# Altium schematic sheet FPGA_GTP.SchDoc: GTP and SATA
size 420 x 297 mm; CheckedBy: T.Janicki; CompanyName: Creotech Instruments SA; DrawnBy: G.Kasprowicz; Organization: CERN; Address1: European Organization for Nuclear Research; Address2: CH-1211 Geneve 23 - Switzerland; DocumentNumber: 10; Revision: -; SheetNumber: 11; SheetTotal: 21; EDA_Number: EDA-xxxx; Projet: Simple VME FMC Carrier; CreateDate: 20/11/2012; CheckedDate: 30/04/2012; DivGrp: BE-CO; Designer: G.Kasprowicz; DocumentName: Fpga_gtp.SchDoc; ModifiedDate: -; Rule: PcbType=ProtelPcb
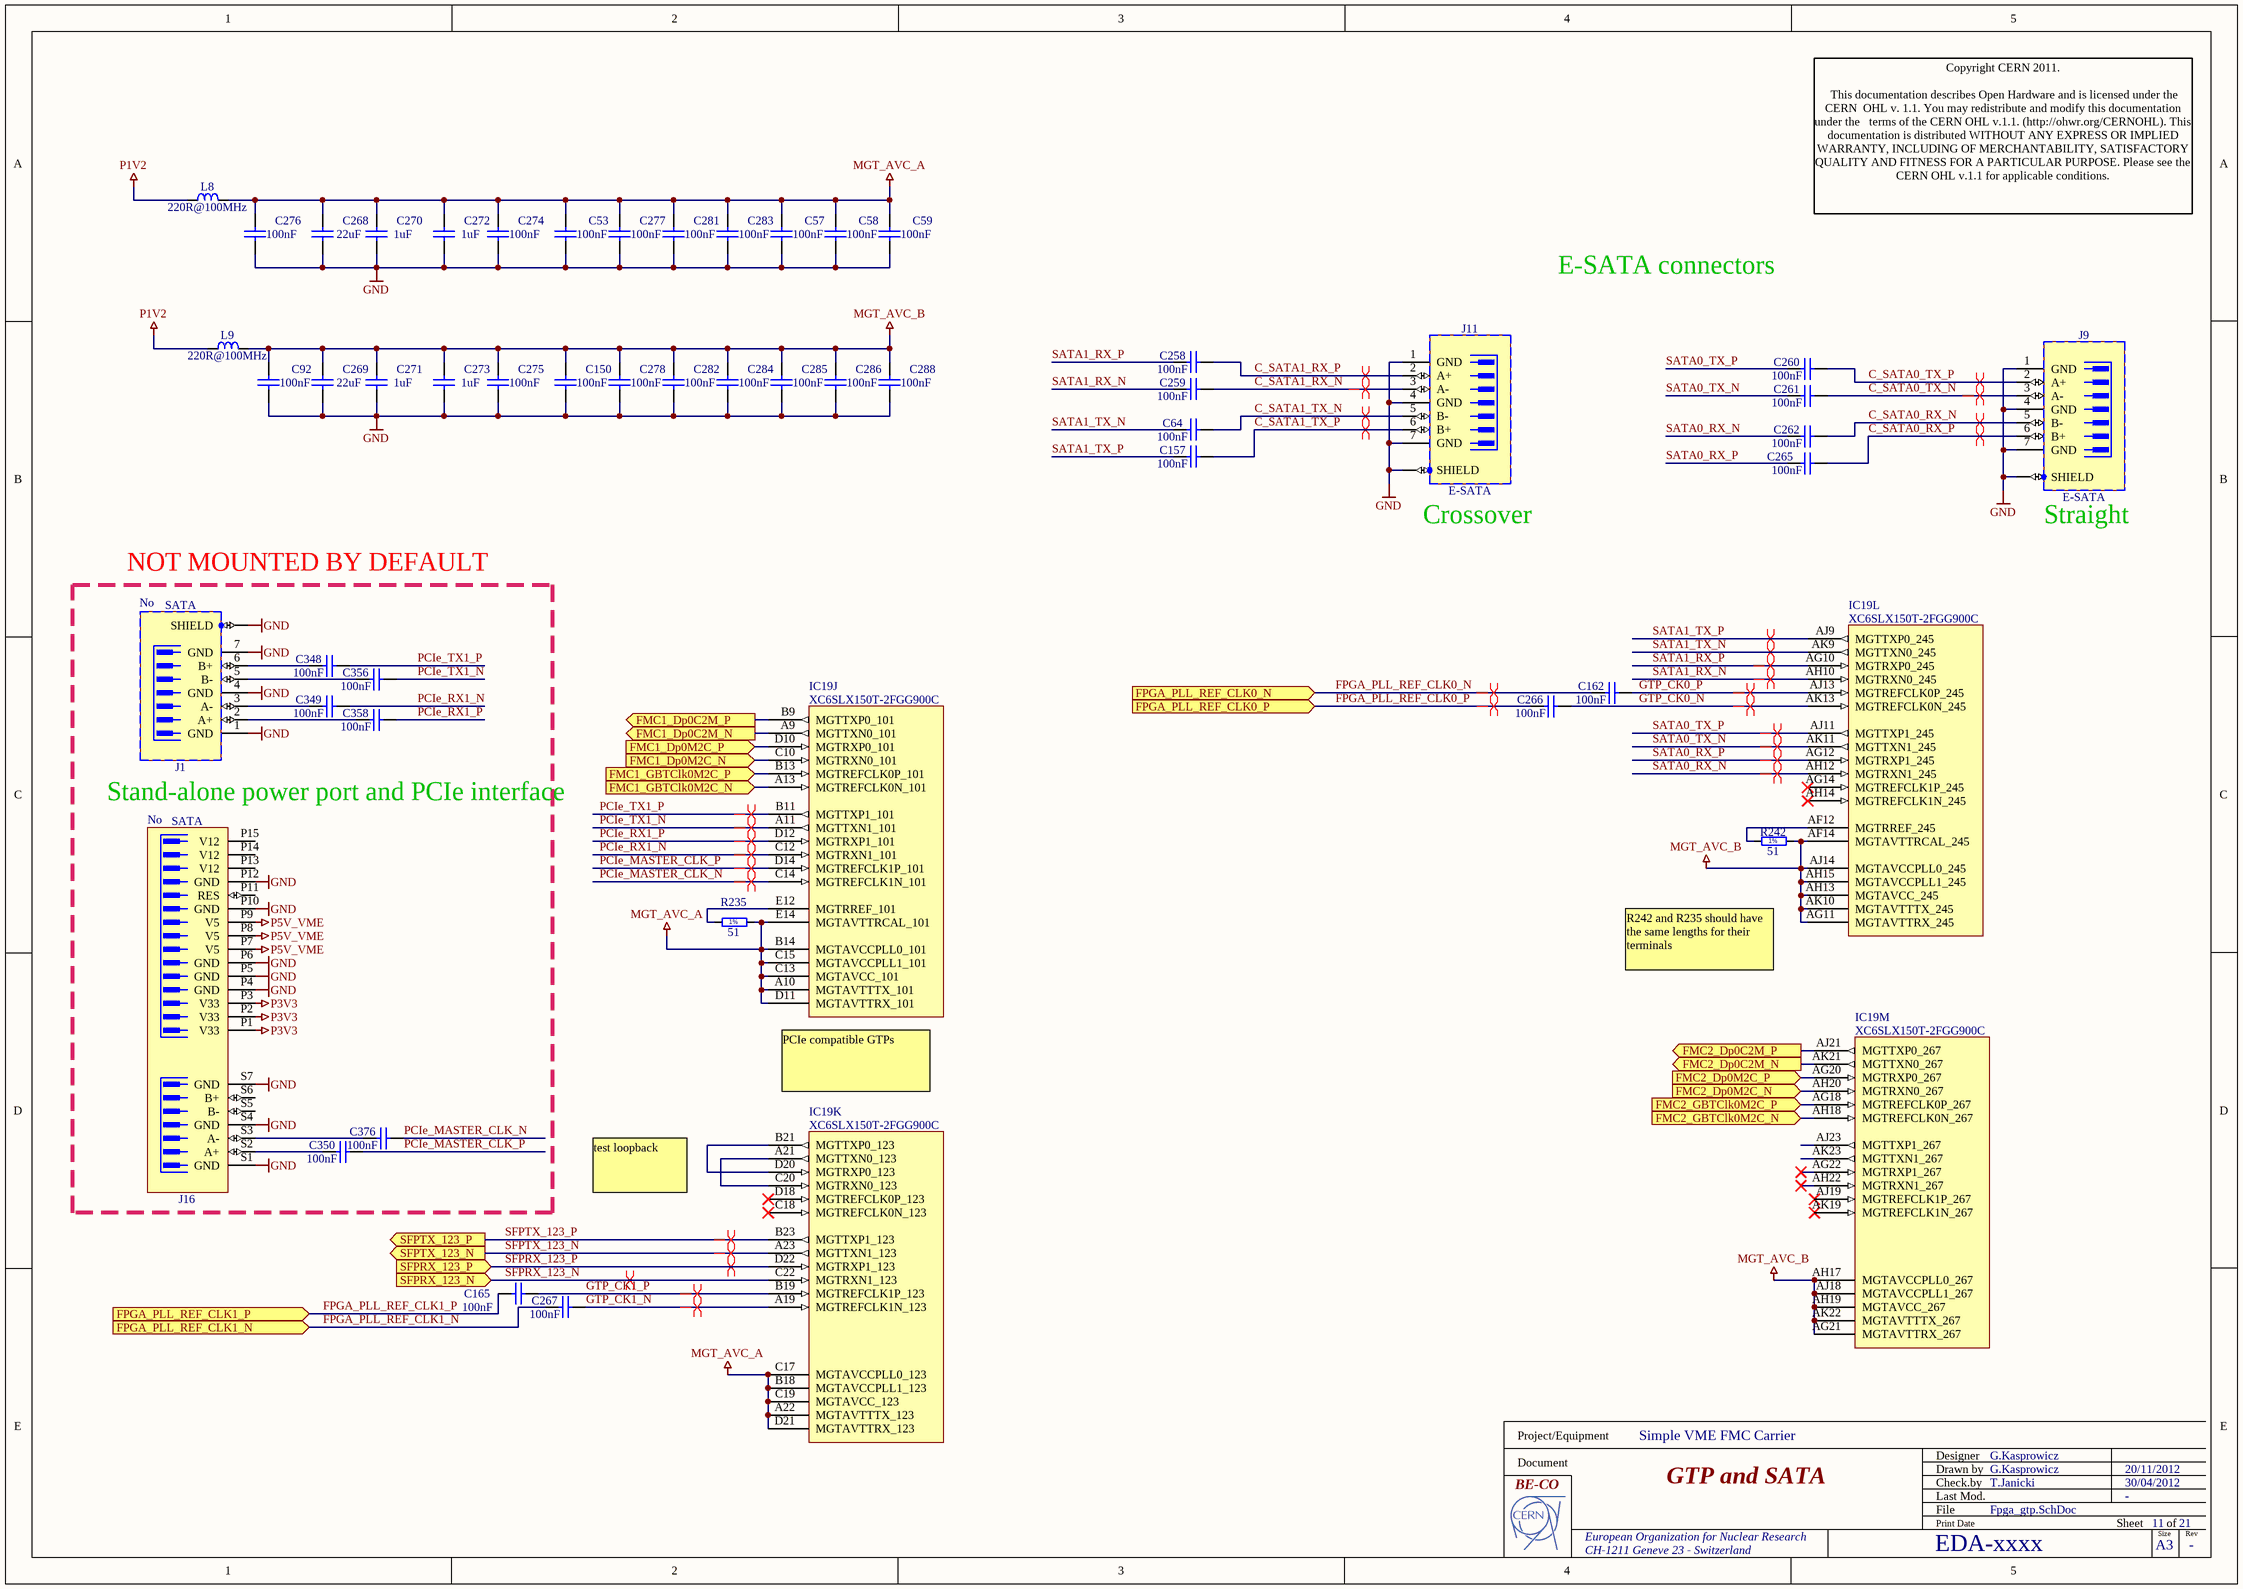
[diagram p0: FPGA_GTP.SchDoc]

## Parts
C53  100nF  [CAPC1005X55N]
C57  100nF  [CAPC1005X55N]
C58  100nF  [CAPC1005X55N]
C59  100nF  [CAPC1005X55N]
C64  100nF  [CAPC1005X55N]
C92  100nF  [CAPC1005X55N]
C150  100nF  [CAPC1005X55N]
C157  100nF  [CAPC1005X55N]
C162  100nF  [CAPC1005X55N]
C165  100nF  [CAPC1005X55N]
C258  100nF  [CAPC1005X55N]
C259  100nF  [CAPC1005X55N]
C260  100nF  [CAPC1005X55N]
C261  100nF  [CAPC1005X55N]
C262  100nF  [CAPC1005X55N]
C265  100nF  [CAPC1005X55N]
C266  100nF  [CAPC1005X55N]
C267  100nF  [CAPC1005X55N]
C268  22uF  [CAPC3216X180N]
C269  22uF  [CAPC3216X180N]
C270  1uF  [CAPC1608X87N]
C271  1uF  [CAPC1608X87N]
C272  1uF  [CAPC1608X87N]
C273  1uF  [CAPC1608X87N]
C274  100nF  [CAPC1005X55N]
C275  100nF  [CAPC1005X55N]
C276  100nF  [CAPC1005X55N]
C277  100nF  [CAPC1005X55N]
C278  100nF  [CAPC1005X55N]
C281  100nF  [CAPC1005X55N]
C282  100nF  [CAPC1005X55N]
C283  100nF  [CAPC1005X55N]
C284  100nF  [CAPC1005X55N]
C285  100nF  [CAPC1005X55N]
C286  100nF  [CAPC1005X55N]
C288  100nF  [CAPC1005X55N]
C348  100nF  [CAPC1005X55N]
C349  100nF  [CAPC1005X55N]
C350  100nF  [CAPC1005X55N]
C356  100nF  [CAPC1005X55N]
C358  100nF  [CAPC1005X55N]
C376  100nF  [CAPC1005X55N]
IC19  XC6SLX150T-2FGG900C  [BGA900C100P30X30_3100X3100X260]  (parts J,K,L,M of 18)
J1  SATA  Mounted: No  [3M_5607-4200-SH]
J9  E-SATA  [FCI_10074141-001LF]
J11  E-SATA  [FCI_10074141-001LF]
J16  SATA  Mounted: No  [MOLEX_87703-0001]
L8  220R@100MHz  [INDC2012X105N]
L9  220R@100MHz  [INDC2012X105N]
R235  51  [RESC1005X40N]
R242  51  [RESC1005X40N]

## Ports
FMC1_Dp0C2M_N (out), FMC1_Dp0C2M_P (out), FMC1_Dp0M2C_N (in), FMC1_Dp0M2C_P (in), FMC1_GBTClk0M2C_N (in), FMC1_GBTClk0M2C_P (in), FMC2_Dp0C2M_N (out), FMC2_Dp0C2M_P (out), FMC2_Dp0M2C_N (in), FMC2_Dp0M2C_P (in), FMC2_GBTClk0M2C_N (in), FMC2_GBTClk0M2C_P (in), FPGA_PLL_REF_CLK0_N (in), FPGA_PLL_REF_CLK0_P (in), FPGA_PLL_REF_CLK1_N (in), FPGA_PLL_REF_CLK1_P (in), SFPRX_123_N (in), SFPRX_123_P (in), SFPTX_123_N (out), SFPTX_123_P (out)

## Nets
GND: C53.1 C57.1 C58.1 C59.1 C92.1 C150.1 C268.1 C269.1 C270.1 C271.1 C272.1 C273.1 C274.1 C275.1 C276.1 C277.1 C278.1 C281.1 C282.1 C283.1 C284.1 C285.1 C286.1 C288.1 J1.1(GND) J1.4(GND) J1.7(GND) J1.8(SHIELD) J9.1(GND) J9.4(GND) J9.7(GND) J9.8(SHIELD) J11.1(GND) J11.4(GND) J11.7(GND) J11.8(SHIELD) J16.P4(GND) J16.P5(GND) J16.P6(GND) J16.P10(GND) J16.P12(GND) J16.S1(GND) J16.S4(GND) J16.S7(GND)
MGT_AVC_A: C53.2 C57.2 C58.2 C59.2 C268.2 C270.2 C272.2 C274.2 C276.2 C277.2 C281.2 C283.2 IC19.A10(MGTAVTTTX_101) IC19.A22(MGTAVTTTX_123) IC19.B14(MGTAVCCPLL0_101) IC19.B18(MGTAVCCPLL1_123) IC19.C13(MGTAVCC_101) IC19.C15(MGTAVCCPLL1_101) IC19.C17(MGTAVCCPLL0_123) IC19.C19(MGTAVCC_123) IC19.D11(MGTAVTTRX_101) IC19.D21(MGTAVTTRX_123) IC19.E14(MGTAVTTRCAL_101) L8.2 R235.2
MGT_AVC_B: C92.2 C150.2 C269.2 C271.2 C273.2 C275.2 C278.2 C282.2 C284.2 C285.2 C286.2 C288.2 IC19.AF14(MGTAVTTRCAL_245) IC19.AG11(MGTAVTTRX_245) IC19.AG21(MGTAVTTRX_267) IC19.AH13(MGTAVCC_245) IC19.AH15(MGTAVCCPLL1_245) IC19.AH17(MGTAVCCPLL0_267) IC19.AH19(MGTAVCC_267) IC19.AJ14(MGTAVCCPLL0_245) IC19.AJ18(MGTAVCCPLL1_267) IC19.AK10(MGTAVTTTX_245) IC19.AK22(MGTAVTTTX_267) L9.2 R242.2
P1V2: L8.1 L9.1
P3V3: J16.P1(V33) J16.P2(V33) J16.P3(V33)
P5V_VME: J16.P7(V5) J16.P8(V5) J16.P9(V5)
C_SATA0_RX_N: C262.2 J9.5(B-)
C_SATA0_RX_P: C265.2 J9.6(B+)
C_SATA0_TX_N: C261.2 J9.3(A-)
C_SATA0_TX_P: C260.2 J9.2(A+)
C_SATA1_RX_N: C259.2 J11.3(A-)
C_SATA1_RX_P: C258.2 J11.2(A+)
C_SATA1_TX_N: C64.2 J11.5(B-)
C_SATA1_TX_P: C157.2 J11.6(B+)
FMC1_Dp0C2M_N: IC19.A9(MGTTXN0_101) ; port FMC1_Dp0C2M_N
FMC1_Dp0C2M_P: IC19.B9(MGTTXP0_101) ; port FMC1_Dp0C2M_P
FMC1_Dp0M2C_N: IC19.C10(MGTRXN0_101) ; port FMC1_Dp0M2C_N
FMC1_Dp0M2C_P: IC19.D10(MGTRXP0_101) ; port FMC1_Dp0M2C_P
FMC1_GBTClk0M2C_N: IC19.A13(MGTREFCLK0N_101) ; port FMC1_GBTClk0M2C_N
FMC1_GBTClk0M2C_P: IC19.B13(MGTREFCLK0P_101) ; port FMC1_GBTClk0M2C_P
FMC2_Dp0C2M_N: IC19.AK21(MGTTXN0_267) ; port FMC2_Dp0C2M_N
FMC2_Dp0C2M_P: IC19.AJ21(MGTTXP0_267) ; port FMC2_Dp0C2M_P
FMC2_Dp0M2C_N: IC19.AH20(MGTRXN0_267) ; port FMC2_Dp0M2C_N
FMC2_Dp0M2C_P: IC19.AG20(MGTRXP0_267) ; port FMC2_Dp0M2C_P
FMC2_GBTClk0M2C_N: IC19.AH18(MGTREFCLK0N_267) ; port FMC2_GBTClk0M2C_N
FMC2_GBTClk0M2C_P: IC19.AG18(MGTREFCLK0P_267) ; port FMC2_GBTClk0M2C_P
FPGA_PLL_REF_CLK0_N: C162.1 ; port FPGA_PLL_REF_CLK0_N
FPGA_PLL_REF_CLK0_P: C266.1 ; port FPGA_PLL_REF_CLK0_P
FPGA_PLL_REF_CLK1_N: C267.1 ; port FPGA_PLL_REF_CLK1_N
FPGA_PLL_REF_CLK1_P: C165.1 ; port FPGA_PLL_REF_CLK1_P
GTP_CK0_N: C266.2 IC19.AK13(MGTREFCLK0N_245)
GTP_CK0_P: C162.2 IC19.AJ13(MGTREFCLK0P_245)
GTP_CK1_N: C267.2 IC19.A19(MGTREFCLK1N_123)
GTP_CK1_P: C165.2 IC19.B19(MGTREFCLK1P_123)
PCIe_MASTER_CLK_N: C376.2 IC19.C14(MGTREFCLK1N_101)
PCIe_MASTER_CLK_P: C350.2 IC19.D14(MGTREFCLK1P_101)
PCIe_RX1_N: C349.2 IC19.C12(MGTRXN1_101)
PCIe_RX1_P: C358.2 IC19.D12(MGTRXP1_101)
PCIe_TX1_N: C356.2 IC19.A11(MGTTXN1_101)
PCIe_TX1_P: C348.2 IC19.B11(MGTTXP1_101)
SATA0_RX_N: C262.1 IC19.AH12(MGTRXN1_245)
SATA0_RX_P: C265.1 IC19.AG12(MGTRXP1_245)
SATA0_TX_N: C261.1 IC19.AK11(MGTTXN1_245)
SATA0_TX_P: C260.1 IC19.AJ11(MGTTXP1_245)
SATA1_RX_N: C259.1 IC19.AH10(MGTRXN0_245)
SATA1_RX_P: C258.1 IC19.AG10(MGTRXP0_245)
SATA1_TX_N: C64.1 IC19.AK9(MGTTXN0_245)
SATA1_TX_P: C157.1 IC19.AJ9(MGTTXP0_245)
SFPRX_123_N: IC19.C22(MGTRXN1_123) ; port SFPRX_123_N
SFPRX_123_P: IC19.D22(MGTRXP1_123) ; port SFPRX_123_P
SFPTX_123_N: IC19.A23(MGTTXN1_123) ; port SFPTX_123_N
SFPTX_123_P: IC19.B23(MGTTXP1_123) ; port SFPTX_123_P
NetC348_1: C348.1 J1.6(B+)
NetC349_1: C349.1 J1.3(A-)
NetC350_1: C350.1 J16.S2(A+)
NetC356_1: C356.1 J1.5(B-)
NetC358_1: C358.1 J1.2(A+)
NetC376_1: C376.1 J16.S3(A-)
NetIC19_A21: IC19.A21(MGTTXN0_123) IC19.C20(MGTRXN0_123)
NetIC19_AF12: IC19.AF12(MGTRREF_245) R242.1
NetIC19_B21: IC19.B21(MGTTXP0_123) IC19.D20(MGTRXP0_123)
NetIC19_E12: IC19.E12(MGTRREF_101) R235.1

Not connected (* = marked no-connect by the designer): IC19 AG14(MGTREFCLK1P_245)* AG22(MGTRXP1_267)* AH14(MGTREFCLK1N_245)* AH22(MGTRXN1_267)* AJ19(MGTREFCLK1P_267)* AJ23(MGTTXP1_267) AK19(MGTREFCLK1N_267)* AK23(MGTTXN1_267) C18(MGTREFCLK0N_123)* D18(MGTREFCLK0P_123)*; J16 P11(RES) P13(V12) P14(V12) P15(V12) S5(B-) S6(B+)

## Layout directives
differential pair: C_SATA0_RX_N, C_SATA0_RX_P, C_SATA0_TX_N, C_SATA0_TX_P, C_SATA1_RX_N, C_SATA1_RX_P, C_SATA1_TX_N, C_SATA1_TX_P, FPGA_PLL_REF_CLK0_N, FPGA_PLL_REF_CLK0_P, GTP_CK0_N, GTP_CK0_P, GTP_CK1_N, GTP_CK1_P, PCIe_MASTER_CLK_N, PCIe_MASTER_CLK_P, PCIe_RX1_N, PCIe_RX1_P, PCIe_TX1_N, PCIe_TX1_P, SATA0_RX_N, SATA0_RX_P, SATA0_TX_N, SATA0_TX_P, SATA1_RX_N, SATA1_RX_P, SATA1_TX_N, SATA1_TX_P, SFPRX_123_N, SFPRX_123_P, SFPTX_123_N, SFPTX_123_P

## Notes on the sheet
- Copyright CERN 2011.
  This documentation describes Open Hardware and is licensed under the CERN  OHL v. 1.1. You may redistribute and modify this documentation under the   terms of the CERN OHL v.1.1. (http://ohwr.org/CERNOHL). This  documentation is distributed WITHOUT ANY EXPRESS OR IMPLIED  WARRANTY, INCLUDING OF MERCHANTABILITY, SATISFACTORY  QUALITY AND FITNESS FOR A PARTICULAR PURPOSE. Please see the  CERN OHL v.1.1 for applicable conditions.
- E-SATA connectors
- (near J11) Crossover
- (near J9) Straight
- (near J1) NOT MOUNTED BY DEFAULT
- Stand-alone power port and PCIe interface
- R242 and R235 should have the same lengths for their terminals
- (near IC19) PCIe compatible GTPs
- test loopback
- Project/Equipment
- Document
- Designer
- Drawn by
- Check.by
- File
- Last Mod.
- Print Date
- Sheet
- Size
- A3
- of
- Rev
- (in symbol R0402_51R_1%_0.0625W_100PPM) 1%

## Library data of the parts
C53 C57-C59 C64 C92 C150 C157 C162 C165 C258-C262 C265-C267 C274-C278 C281-C286 C288 C348-C350 C356 C358 C376 = CC0402_100NF_16V_10%_X7R: Non-polarised capacitor; Part Description: SMD Multilayer Chip Ceramic Capacitor; Manufacturer: GENERIC; Manufacturer1 Part Number: 223878715649; Voltage: 16V; TC: X7R; Tolerance: ±10%; Table: Capacitors SMD; Part Number: CC0402_100NF_16V_10%_X7R; Component Kind: Standard; Component Type: Standard; Pin Count: 2; Value: 100nF; Status: Not Recommended; Manufacturer Part Number: CC0402_100NF_16V_10%_X7R; Case: 0402; Mounted: Yes; Socket: No; SMD: Yes; Manufacturer1 Example: PHYCOMP; Manufacturer1 ComponentHeight: 0.55mm; HelpURL: \\cern.ch\dfs\Applications\Altium\Datasheets\CC0402_X7R_PHYCOMP.pdf; Author: CERN DEM JLC; CreateDate: 03/12/2007; LatestRevisionDate: 03/12/2007
C268 C269 = CC1206_22UF_10V_10%_X7R: Non-polarised capacitor; Part Description: SMD Multilayer Chip Ceramic Capacitor; Manufacturer: GENERIC; Manufacturer1 Part Number: GRM31CR71A226KE15L; Voltage: 10V; TC: X7R; Tolerance: ±10%; Table: Capacitors SMD; Part Number: CC1206_22UF_10V_10%_X7R; Component Kind: Standard; Component Type: Standard; Pin Count: 2; Value: 22uF; Status: Preferred; Manufacturer Part Number: CC1206_22UF_10V_10%_X7R; Case: 1206; Mounted: Yes; Socket: No; SMD: Yes; Manufacturer1 Example: MURATA; Manufacturer1 ComponentHeight: 1.8mm; HelpURL: \\cern.ch\dfs\Applications\Altium\Datasheets\CC1206_X7R_MURATA_GRM-HI-CAP.pdf; Author: CERN DEM JLC; CreateDate: 2010-06-08; LatestRevisionDate: 2010-06-08
C270-C273 = CC0603_1UF_16V_10%_X7R: Non-polarised capacitor; Part Description: SMD Multilayer Chip Ceramic Capacitor; Manufacturer: GENERIC; Manufacturer1 Part Number: 223824613663; Voltage: 16V; TC: X7R; Tolerance: ±10%; Table: Capacitors SMD; Part Number: CC0603_1UF_16V_10%_X7R; Component Kind: Standard; Component Type: Standard; Pin Count: 2; Value: 1uF; Status: Preferred; Manufacturer Part Number: CC0603_1uF_16V_10%_X7R; Case: 0603; Mounted: Yes; Socket: No; SMD: Yes; Manufacturer1 Example: PHYCOMP; Manufacturer1 ComponentHeight: 0.87mm; HelpURL: \\cern.ch\dfs\Applications\Altium\Datasheets\CC0805_X5R_PHYCOMP_HC.pdf; Author: CERN DEM JLC; CreateDate: 03/12/2007; LatestRevisionDate: 03/12/2007
IC19 = XC6SLX150T-2FGG900C: SPARTAN-6, FPGA, 900-Ball BGA, Commercial Grade, Pb-Free; Part Description: SPARTAN-6, FPGA, 540 User I/Os, 8 GTPs, 900-Ball BGA, Commercial Grade, Pb-Free; Manufacturer: XILINX; Table: Logic; Part Number: XC6SLX150T-2FGG900C; Component Kind: Standard; Component Type: Standard; Device: XC6SLX150T-2FGG900C; PackageDescription: BGA,1.00mm pitch, square; 900 pin, 30 columns X 30 rows, 31.00mm X 31.00mm X 2.60mm H, IPC Medium Density; Manufacturer Part Number: XC6SLX150T-2FGG900C; Pin Count: 900; Case: BGA900; Mounted: Yes; Socket: No; SMD: Yes; ComponentHeight: 2.6mm; HelpURL: \\cern.ch\dfs\Applications\Altium\Datasheets\XC6SLX150T-2FGG900C.pdf; ComponentLink1URL: \\cern.ch\dfs\Applications\Altium\Datasheets\XC6SLX150T-2FGG900C_Package-Pinouts.pdf; ComponentLink1Description: Package/Pinouts; Author: CERN DEM JLC; CreateDate: 2009-11-17; LatestRevisionDate: 2009-11-17
J1 = 3M_5607-4200-SH: 7 Pin + 1 Shield SATA Receptacle; Part Description: Signal Plug, Surfacemount, Right Angle,  Serial Advanced Technology Attachment (SATA) Connector, 5607 Series; Manufacturer: 3M; Part Number: 3M_5607-4200-SH; Component Kind: Standard; Component Type: Standard; Pin Count: 8; Family: SATA; Socket: No; SMD: Yes; Status: None; Manufacturer Part Number: 5607-4200-SH; ComponentHeight: 4mm; HelpURL: \\cern.ch\dfs\Applications\Altium\Datasheets\3M_5607-4200-SH.pdf; Author: CERN DEM JLC; CreateDate: 2011-02-14; LatestRevisionDate: 2011-05-31; Table: 3M
J9 J11 = FCI_10074141-001LF: 7 Pin + 1 Shield SATA Receptacle; Part Description: Right-Angle, Upright Plug, Through-Hole External Serial ATA Plug (eSATA); Manufacturer: FCI; Part Number: FCI_10074141-001LF; Component Kind: Standard; Component Type: Standard; Pin Count: 8; Family: E-SATA; Mounted: Yes; Socket: No; SMD: No; Status: None; Manufacturer Part Number: 10074141-001LF; ComponentHeight: 19.6mm; HelpURL: \\cern.ch\dfs\Applications\Altium\Datasheets\FCI_10074141-001LF.pdf; Author: CERN DEM JLC; CreateDate: 2010-03-18; LatestRevisionDate: 2010-07-16; Table: FCI
J16 = MOLEX_87703-0001: 7 Signal Pin + 15 Power Pin SATA Connecteur; Part Description: 1.27mm Pitch, 7 Signal + 15 Power Contacts Serial ATA Device Plug; Manufacturer: MOLEX; Part Number: MOLEX_87703-0001; Component Kind: Standard; Component Type: Standard; Pin Count: 22; Family: SATA; Socket: No; SMD: Yes; Status: None; Manufacturer Part Number: 87703-0001; ComponentHeight: 4mm; HelpURL: \\cern.ch\dfs\Applications\Altium\Datasheets\MOLEX_87703-0001.pdf; Author: CERN DEM JLC; CreateDate: 2012-04-17; LatestRevisionDate: 2012-04-17; Table: MOLEX
L8 L9 = IND0805_MURATA_BLM21PG221SN1D: Inductor; Part Description: SMD EMIFIL Suppression Chip Bead Ferrite; Manufacturer: MURATA; Power: 2A; Resistance: 0.05R; Tolerance: ±25%; Table: Inductors SMD; Part Number: IND0805_MURATA_BLM21PG221SN1D; Component Kind: Standard; Component Type: Standard; Pin Count: 2; Value: 220R@100MHz; Status: None; Manufacturer Part Number: BLM21PG221SN1D; Case: 0805; Mounted: Yes; Socket: No; SMD: Yes; ComponentHeight: 1.05mm; HelpURL: \\cern.ch\dfs\Applications\Altium\Datasheets\IND0402_MURATA_BLM21P.pdf; Author: CERN DEM JLC; CreateDate: 25/01/2010; LatestRevisionDate: 25/01/2010
R235 R242 = R0402_51R_1%_0.0625W_100PPM: Resistor - 1%; Part Description: General Purpose Thick Film Chip Resistor; Manufacturer: GENERIC; Manufacturer1 Part Number: 232270675109; TC: ±100ppm/°C; Table: Resistors SMD; Part Number: R0402_51R_1%_0.0625W_100PPM; Component Kind: Standard; Component Type: Standard; Pin Count: 2; Value: 51; Status: Not recommended; Power: 0.0625W; Tolerance: ±1%; Manufacturer Part Number: R0402_51R_1%_0.0625W_100PPM; Case: 0402; Mounted: Yes; Socket: No; SMD: Yes; Manufacturer1 Example: PHYCOMP; Manufacturer1 ComponentHeight: 0.4mm; HelpURL: \\cern.ch\dfs\Applications\Altium\Datasheets\R0402_Phycomp_RC0402.pdf; Author: CERN DEM JLC; CreateDate: 03/12/2007; LatestRevisionDate: 13/03/2008